# EAGLE schematic mask_supply (EAGLE 9.5.2)
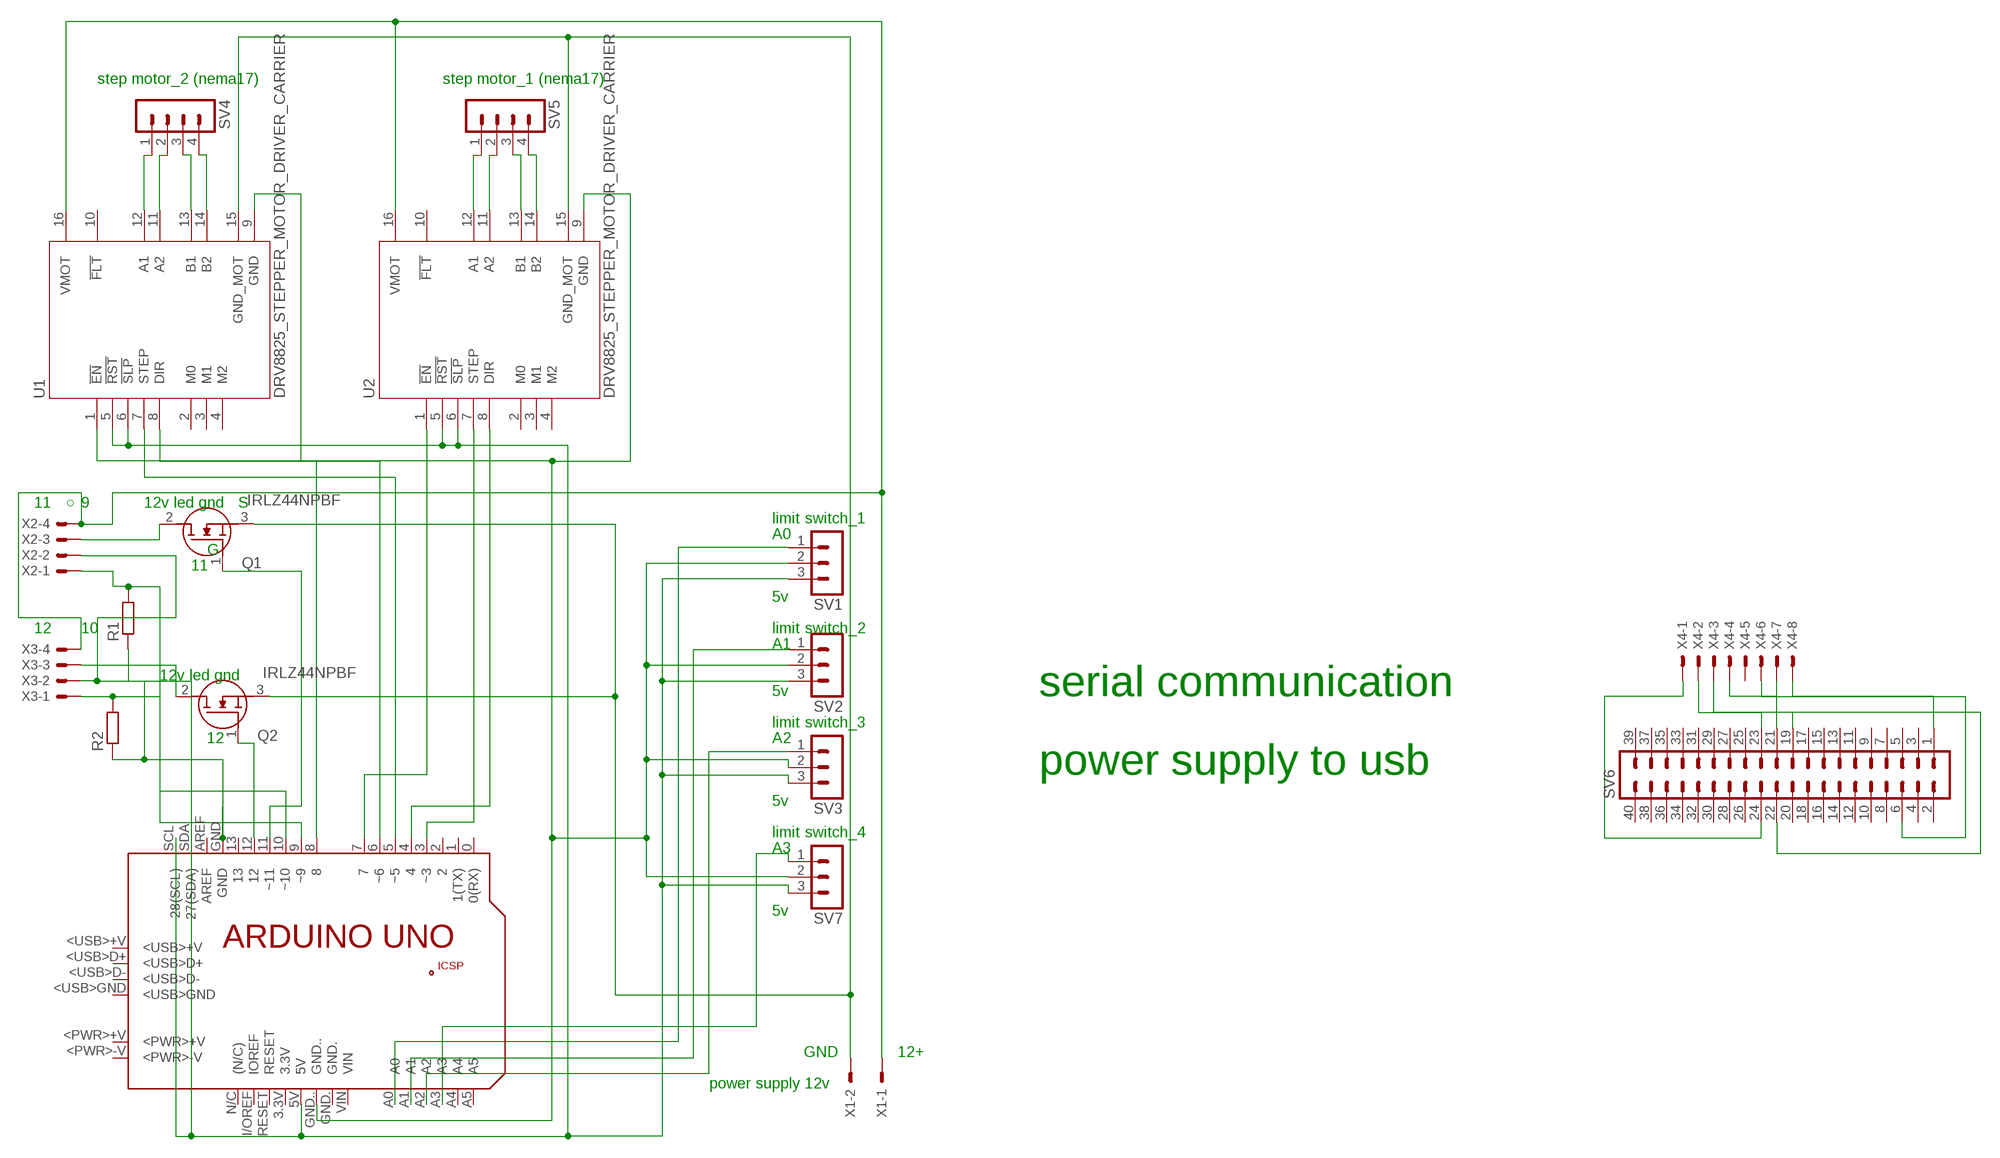
[diagram p0: schematic, sheet 1]

## Parts
PCB1  ARDUINO_UNO  [ARDUINO_UNO]
Q1  IRLZ44NPBF  [TO254P469X1042X1967-3P]
Q2  IRLZ44NPBF  [TO254P469X1042X1967-3P]
R1  R-EU_0309/10  [0309/10]
R2  R-EU_0309/10  [0309/10]
SV1  MA03-1  [MA03-1]
SV2  MA03-1  [MA03-1]
SV3  MA03-1  [MA03-1]
SV4  MA04-1  [MA04-1]
SV5  MA04-1  [MA04-1]
SV6  MA20-2  [MA20-2]
SV7  MA03-1  [MA03-1]
U1  DRV8825_STEPPER_MOTOR_DRIVER_CARRIER  [IC_DRV8825_STEPPER_MOTOR_DRIVER_CARRIER]
U2  DRV8825_STEPPER_MOTOR_DRIVER_CARRIER  [IC_DRV8825_STEPPER_MOTOR_DRIVER_CARRIER]
X1  KK-156-2  [KK-156-2]
X2  KK-156-4  [KK-156-4]
X3  KK-156-4  [KK-156-4]
X4  KK-156-8  [KK-156-8]

## Nets
N$1: SV5.4 U2.14(B2)
N$2: SV5.3 U2.13(B1)
N$3: SV5.2 U2.11(A2)
N$4: SV5.1 U2.12(A1)
N$5: SV4.4 U1.14(B2)
N$6: SV4.3 U1.13(B1)
N$7: SV4.2 U1.11(A2)
N$8: SV4.1 U1.12(A1)
N$9: PCB1.5V PCB1.SCL(28(SCL)) PCB1.SDA(27(SDA)) SV1.3 SV2.3 SV3.3 SV7.3 U1.5(!RST) U1.6(!SLP) U2.5(!RST) U2.6(!SLP) X2.2 X3.2
N$10: PCB1.GND.. SV1.2 SV2.2 SV3.2 SV7.2 U1.9(GND) U2.9(GND)
N$11: PCB1.3(~3) U2.7(STEP)
N$12: PCB1.4 U2.8(DIR)
N$13: PCB1.5(~5) U1.7(STEP)
N$14: PCB1.6(~6) U1.8(DIR)
N$15: PCB1.7 U2.1(!EN)
N$16: PCB1.8 U1.1(!EN)
N$17: PCB1.A0 SV1.1
N$18: U1.16(VMOT) U2.16(VMOT) X1.1 X2.4 X3.4
N$19: PCB1.A1 SV2.1
N$20: PCB1.A2 SV3.1
N$21: Q1.3(S) Q2.3(S) U1.15(GND_MOT) U2.15(GND_MOT) X1.2
N$22: SV6.1 X4.8
N$23: SV6.6 X4.6
N$24: SV6.19 X4.3
N$25: SV6.22 X4.7
N$26: SV6.21 X4.4
N$27: SV6.23 X4.2
N$28: SV6.24 X4.1
N$29: PCB1.A3 SV7.1
N$30: PCB1.GND R1.1 R2.1
N$31: PCB1.11(~11) Q1.1(G)
N$32: PCB1.12 Q2.1(G)
N$33: PCB1.9(~9) R1.2 X2.1
N$34: PCB1.10(~10) R2.2 X3.1
N$35: Q1.2(D) X2.3
N$36: Q2.2(D) X3.3
Unconnected: PCB1.0(0(RX)) PCB1.1(1(TX)) PCB1.2 PCB1.3.3V PCB1.13 PCB1.+5V PCB1.<PWR>+V PCB1.<PWR>-V PCB1.<USB>+V PCB1.<USB>D+ PCB1.<USB>D- PCB1.<USB>GND PCB1.A4 PCB1.A5 PCB1.AREF PCB1.GND. PCB1.GND_ PCB1.I/OREF(IOREF) PCB1.MISO PCB1.MOSI PCB1.N/C((N/C)) PCB1.RESET PCB1.RESET. PCB1.SCK PCB1.VIN SV6.2 SV6.3 SV6.4 SV6.5 SV6.7 SV6.8 SV6.9 SV6.10 SV6.11 SV6.12 SV6.13 SV6.14 SV6.15 SV6.16 SV6.17 SV6.18 SV6.20 SV6.25 SV6.26 SV6.27 SV6.28 SV6.29 SV6.30 SV6.31 SV6.32 SV6.33 SV6.34 SV6.35 SV6.36 SV6.37 SV6.38 SV6.39 SV6.40 U1.2(M0) U1.3(M1) U1.4(M2) U1.10(!FLT) U2.2(M0) U2.3(M1) U2.4(M2) U2.10(!FLT) X4.5

## Notes on the sheet
- step motor_2 (nema17) | step motor_1 (nema17)
- 11 | ○ | 9 | 12v led gnd | S
- limit switch_1
- A0
- G
- 11
- 5v
- 12 | △ | 10 | limit switch_2
- A1
- 12v led gnd
- 5v | serial communication
- limit switch_3
- 12 | A2
- power supply to usb
- 5v
- limit switch_4
- A3
- 5v
- GND | 12+
- power supply 12v

## Library data of the parts
PCB1 = E14_Arduino_revC:ARDUINO_UNO: Device for representing an Arduino Uno board with a footprint in an EAGLE design. Created by Dave Young for Element14. More EAGLE documentation at: http://www.element14.com/community/community/knode/cadsoft_eagle
Q1 Q2 = SamacSys_Parts:IRLZ44NPBF: N-channel MOSFET,IRLZ44N 47A 55V Source: Datasheet <http://www.irf.com/product-info/datasheets/data/irlz44n.pdf>; DESCRIPTION: N-channel MOSFET,IRLZ44N 47A 55V; HEIGHT: 4.69mm; MANUFACTURER_NAME: International Rectifier; MANUFACTURER_PART_NUMBER: IRLZ44NPBF; RS_PART_NUMBER: 0301035; RS_PRICE-STOCK: http://uk.rs-online.com/web/p/products/0301035
R1 R2 = rcl:R-EU_: RESISTOR, European symbol; SPICEPREFIX: R
SV1-SV3 SV7 = con-lstb:MA03-1: PIN HEADER; OC_FARNELL: unknown; OC_NEWARK: unknown
SV4 SV5 = con-lstb:MA04-1: PIN HEADER; OC_FARNELL: unknown; OC_NEWARK: unknown
SV6 = con-lstb:MA20-2: PIN HEADER; OC_FARNELL: unknown; OC_NEWARK: unknown
U1 U2 = DRV8825_STEPPER_MOTOR_DRIVER_CARRIER:DRV8825_STEPPER_MOTOR_DRIVER_CARRIER: Stepper motor controler; IC: DRV8825; 1.5A; Uin mot: 8.2÷45V; AVAILABILITY: Unavailable; DESCRIPTION: DRV8825 Motor Controller/Driver Power Management Evaluation Board; MF: Pololu; MP: DRV8825 STEPPER MOTOR DRIVER CARRIER; PACKAGE: None; PRICE: None
X1 = con-molex:KK-156-2: KK 156 HEADER Source: http://www.molex.com/pdm_docs/sd/026604100_sd.pdf; MF: MOLEX; OC_FARNELL: unknown; OC_NEWARK: unknown
X2 X3 = con-molex:KK-156-4: KK 156 HEADER Source: http://www.molex.com/pdm_docs/sd/026604100_sd.pdf; MF: MOLEX; OC_FARNELL: unknown; OC_NEWARK: unknown
X4 = con-molex:KK-156-8: KK 156 HEADER Source: http://www.molex.com/pdm_docs/sd/026604100_sd.pdf; MF: MOLEX; OC_FARNELL: unknown; OC_NEWARK: unknown